# EAGLE design Socket (EAGLE 6.4)
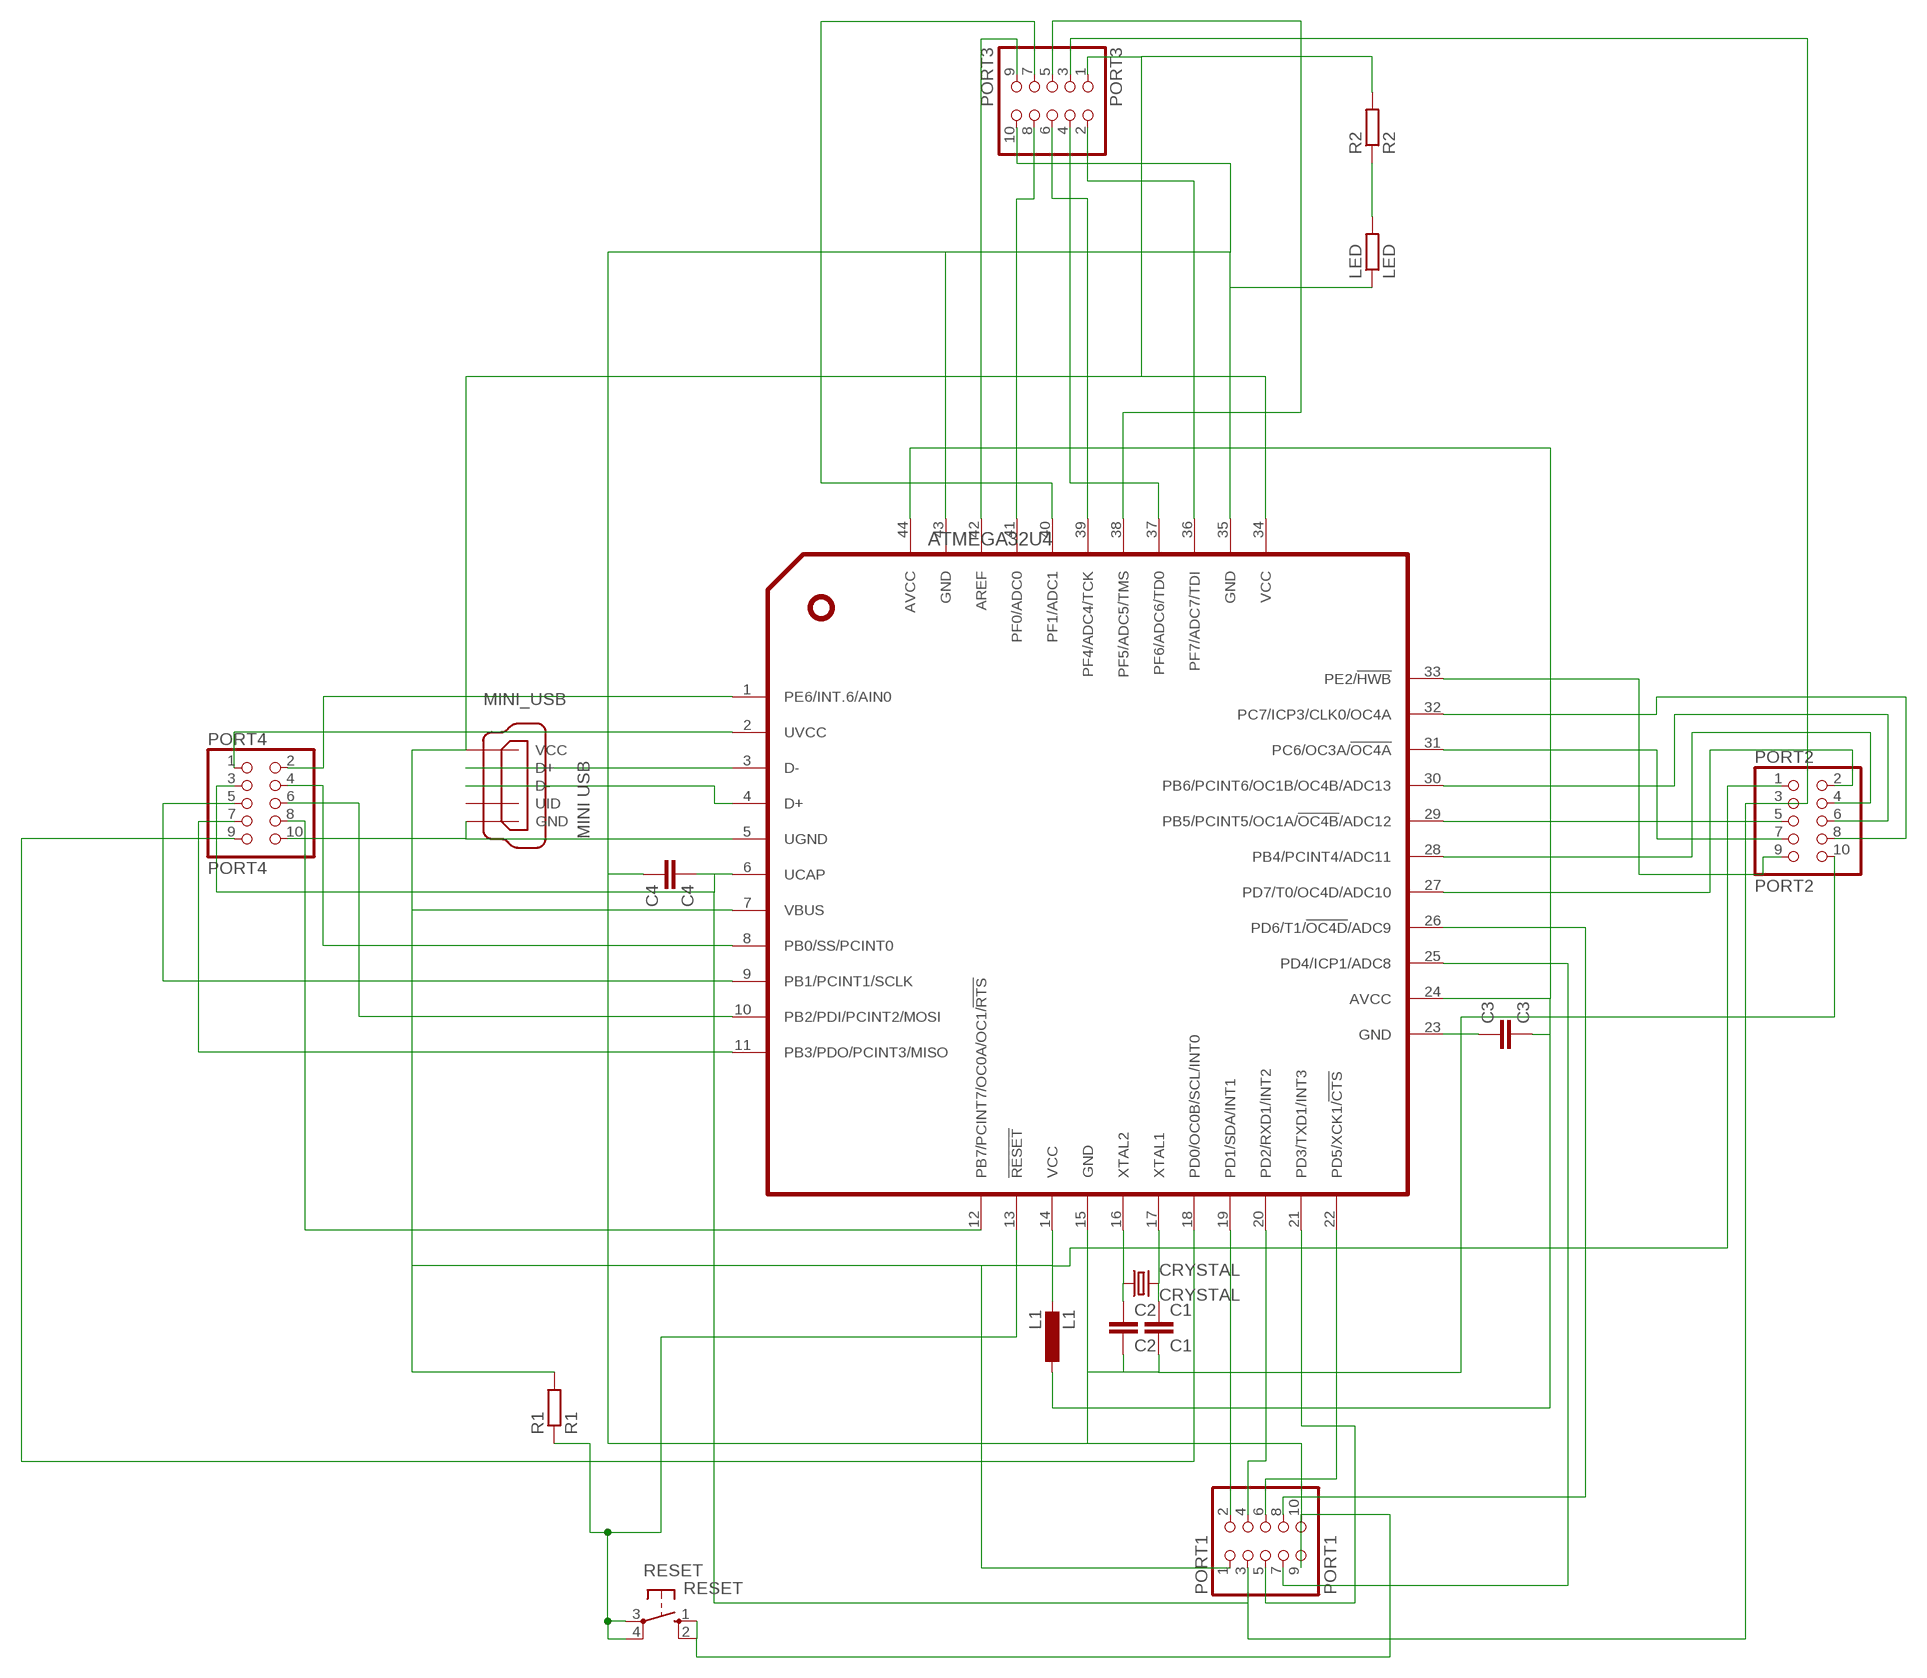
[diagram p0: schematic, sheet 1]

## Parts
ATMEGA32U4  ATMEGA32U4  AT-MEGA16/32-U4  [TQFP44]
C1  C1  C-EUC0603  [C0603]
C2  C2  C-EUC0603  [C0603]
C3  C3  C-EUC0603  [C0603]
C4  C4  C-EUC0603  [C0603]
CRYSTAL  CRYSTAL  CRYSTALHC49UP  [HC49UP]
L1  L1  L-EUL2012C  [L2012C]
LED  LED  R-EU_R0603  [R0603]
MINI_USB  MINI USB  MINI-USB-UX60-MB-5S8  [UX60-MB-5S8]
PORT1  PORT1  PINHD-2X5  [2X05]
PORT2  PORT2  PINHD-2X5  [2X05]
PORT3  PORT3  PINHD-2X5  [2X05]
PORT4  PORT4  PINHD-2X5  [2X05]
R1  R1  R-EU_R0603  [R0603]
R2  R2  R-EU_R0603  [R0603]
RESET  RESET  10-XX  [B3F-10XX]

## Nets
3.3VCC: ATMEGA32U4.6(UCAP) C4.1 PORT1.3 PORT2.3 PORT3.3 PORT4.3
5VCC: ATMEGA32U4.2(UVCC) ATMEGA32U4.7(VBUS) ATMEGA32U4.14(VCC) ATMEGA32U4.34(VCC) L1.2 MINI_USB.VCC PORT1.1 PORT2.1 PORT3.1 PORT4.1 R1.2 R2.2
D+: ATMEGA32U4.4(D+) MINI_USB.D-
GND: ATMEGA32U4.5(UGND) ATMEGA32U4.15(GND) ATMEGA32U4.23(GND) ATMEGA32U4.35(GND) ATMEGA32U4.43(GND) C1.2 C2.2 C3.1 C4.2 LED.1 MINI_USB.GND MINI_USB.GND1(GND) MINI_USB.GND2(GND) MINI_USB.GND3(GND) MINI_USB.GND4(GND) PORT1.9 PORT1.10 PORT2.10 PORT3.10 PORT4.10 RESET.1(S) RESET.2(S1)
N$1: ATMEGA32U4.16(XTAL2) C2.1 CRYSTAL.1
N$2: ATMEGA32U4.17(XTAL1) C1.1 CRYSTAL.2
N$3: ATMEGA32U4.1(PE6/INT.6/AIN0) PORT4.2
N$4: LED.2 R2.1
N$5: ATMEGA32U4.24(AVCC) ATMEGA32U4.44(AVCC) C3.2 L1.1
N$6: ATMEGA32U4.8(PB0/SS/PCINT0) PORT4.4
N$7: ATMEGA32U4.9(PB1/PCINT1/SCLK) PORT4.5
N$8: ATMEGA32U4.3(D-) MINI_USB.D+
N$10: ATMEGA32U4.13(!RESET) R1.1 RESET.3(P) RESET.4(P1)
N$12: ATMEGA32U4.10(PB2/PDI/PCINT2/MOSI) PORT4.6
N$13: ATMEGA32U4.11(PB3/PDO/PCINT3/MISO) PORT4.7
N$14: ATMEGA32U4.12(PB7/PCINT7/OC0A/OC1/!RTS) PORT4.8
N$15: ATMEGA32U4.18(PD0/OC0B/SCL/INT0) PORT4.9
N$16: ATMEGA32U4.19(PD1/SDA/INT1) PORT1.2
N$17: ATMEGA32U4.20(PD2/RXD1/INT2) PORT1.4
N$18: ATMEGA32U4.21(PD3/TXD1/INT3) PORT1.5
N$19: ATMEGA32U4.22(PD5/XCK1/!CTS) PORT1.6
N$20: ATMEGA32U4.25(PD4/ICP1/ADC8) PORT1.7
N$21: ATMEGA32U4.26(PD6/T1/!OC4D!/ADC9) PORT1.8
N$22: ATMEGA32U4.36(PF7/ADC7/TDI) PORT3.2
N$23: ATMEGA32U4.27(PD7/T0/OC4D/ADC10) PORT2.2
N$24: ATMEGA32U4.28(PB4/PCINT4/ADC11) PORT2.4
N$25: ATMEGA32U4.29(PB5/PCINT5/OC1A/!OC4B!/ADC12) PORT2.5
N$26: ATMEGA32U4.30(PB6/PCINT6/OC1B/OC4B/ADC13) PORT2.6
N$27: ATMEGA32U4.31(PC6/OC3A/!OC4A) PORT2.7
N$28: ATMEGA32U4.32(PC7/ICP3/CLK0/OC4A) PORT2.8
N$29: ATMEGA32U4.33(PE2/!HWB) PORT2.9
N$30: ATMEGA32U4.37(PF6/ADC6/TD0) PORT3.4
N$31: ATMEGA32U4.38(PF5/ADC5/TMS) PORT3.5
N$33: ATMEGA32U4.40(PF1/ADC1) PORT3.7
N$34: ATMEGA32U4.41(PF0/ADC0) PORT3.8
N$35: ATMEGA32U4.42(AREF) PORT3.9
PORT3: ATMEGA32U4.39(PF4/ADC4/TCK) PORT3.6
Unconnected: MINI_USB.UID

## Library data of the parts
ATMEGA32U4 = atmel2:AT-MEGA16/32-U4
C1-C4 = rcl:C-EU: CAPACITOR, European symbol
CRYSTAL = crystal:CRYSTAL: CRYSTAL; OC_FARNELL: unknown; OC_NEWARK: unknown
L1 = rcl:L-EU: INDUCTOR, European symbol
LED R1 R2 = rcl:R-EU_: RESISTOR, European symbol
MINI_USB = con-hirose:MINI-USB-: MINI USB Connector Source: http://www.hirose.co.jp/cataloge_hp/e24000019.pdf; OC_FARNELL: unknown; OC_NEWARK: unknown
PORT1-PORT4 = pinhead:PINHD-2X5: PIN HEADER
RESET = switch-omron:10-XX: OMRON SWITCH; MPN: B3F-1000; OC_FARNELL: 176432; OC_NEWARK: 36M3542

## Board
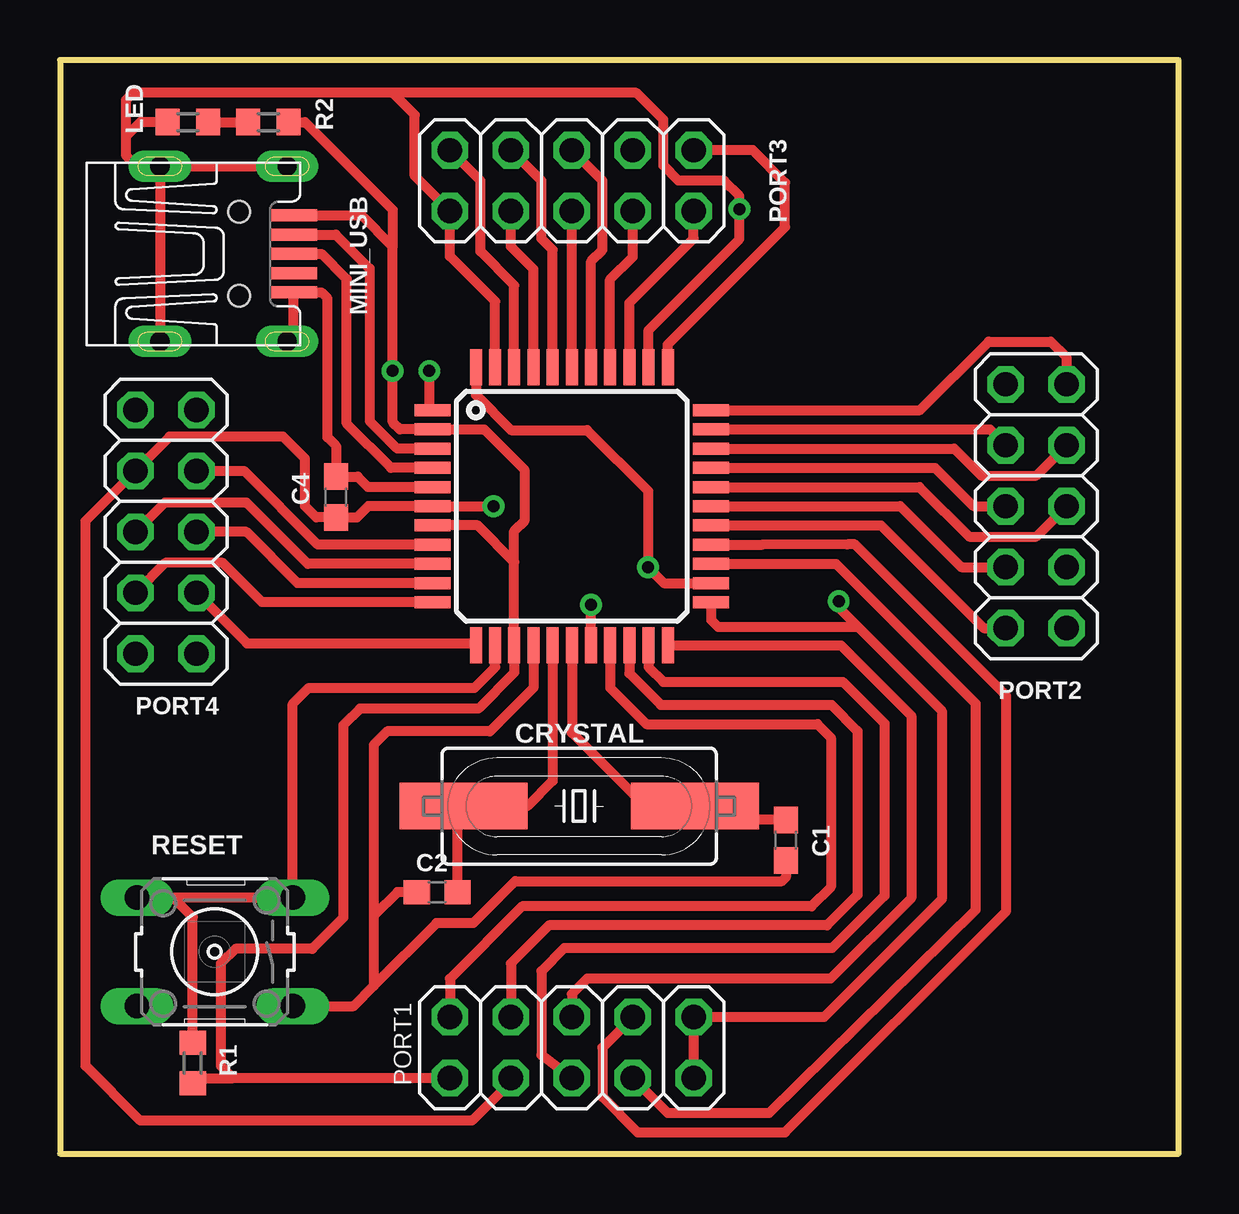
[diagram p1: board, top side]
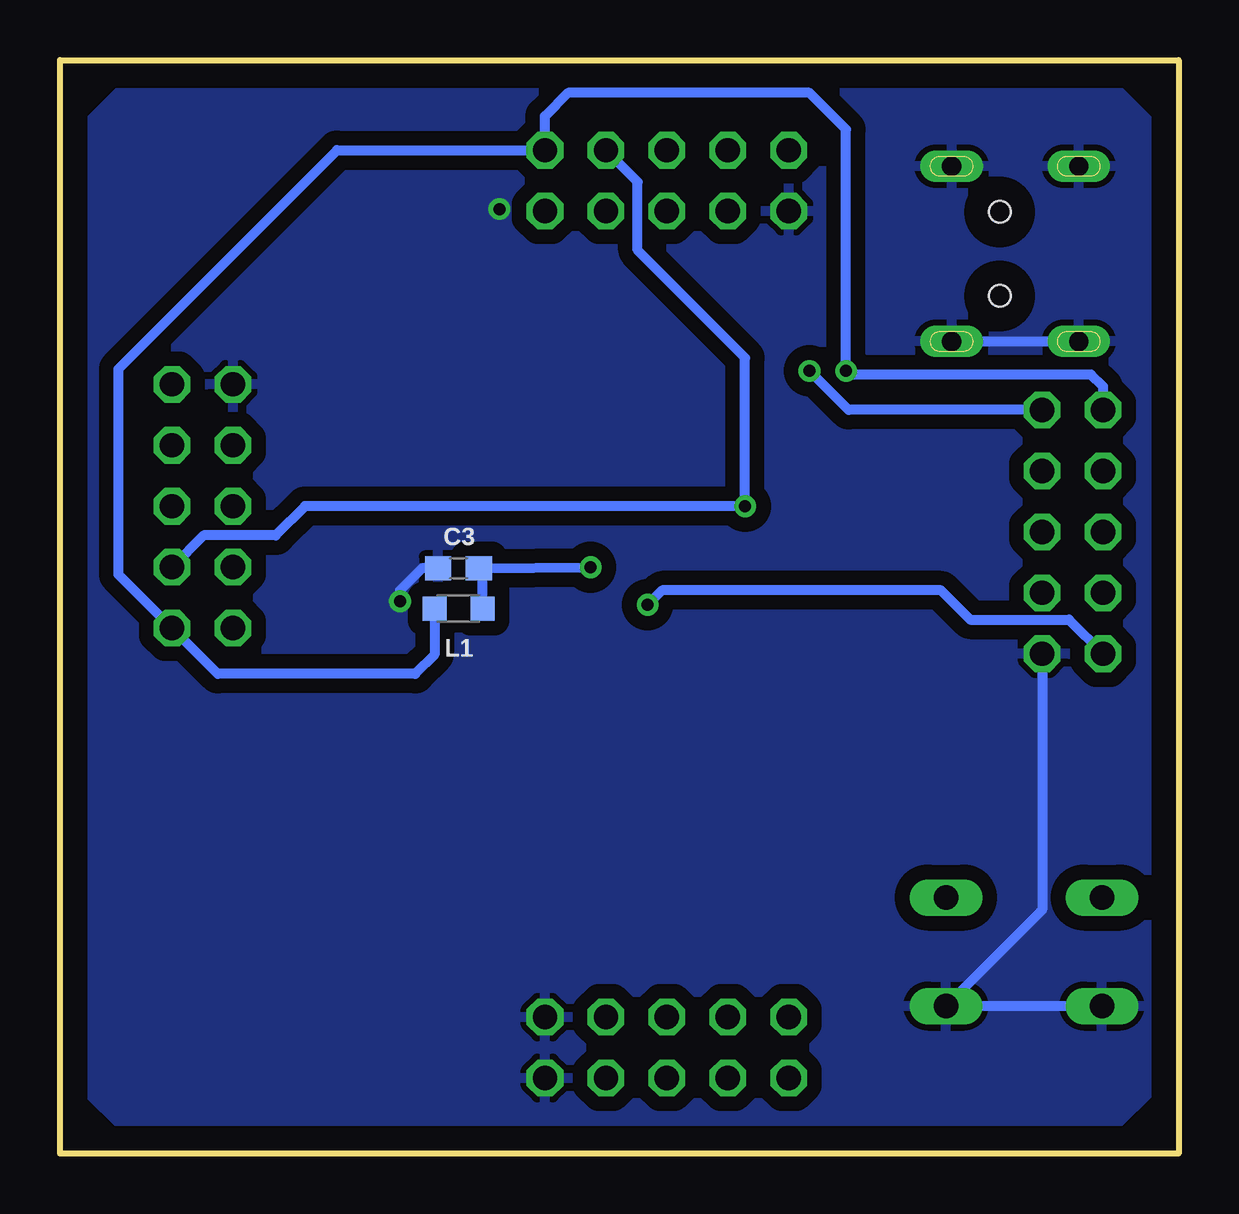
[diagram p2: board, bottom side, seen from below]

Size 46.63 x 45.57 mm. Coordinates in mm from the lower left corner, seen from the top.
Outline: 0,0 46.63,0 46.63,45.57 0,45.57 0,0
Copper layers (1*16): Top 0.035mm / dielectric 1.5mm / Bottom 0.035mm
Design rules: minimum track width 10mil, minimum drill 24mil, track to track 8mil, track to pad 8mil, pad to pad 8mil, via to via 8mil, smd to smd 8mil, copper to edge 40mil, drill to drill 8mil, minimum pad ring 10mil, minimum via ring 8mil, stop-mask expansion 4mil, vias tented up to drill 0mil, thermal gap 10mil

### Footprints (pad centres in the part's own frame; a part is rotated, then mirrored left to right if it is on the bottom)
TQFP44 = smd 1.5 x 0.5: 1 -5.8,4; 2 -5.8,3.2; 3 -5.8,2.4; 4 -5.8,1.6; 5 -5.8,0.8; 6 -5.8,0; 7 -5.8,-0.8; 8 -5.8,-1.6; 9 -5.8,-2.4; 10 -5.8,-3.2; 11 -5.8,-4; 23 5.8,-4; 24 5.8,-3.2; 25 5.8,-2.4; 26 5.8,-1.6; 27 5.8,-0.8; 28 5.8,0; 29 5.8,0.8; 30 5.8,1.6; 31 5.8,2.4; 32 5.8,3.2; 33 5.8,4 | smd 0.5 x 1.5: 12 -4,-5.8; 13 -3.2,-5.8; 14 -2.4,-5.8; 15 -1.6,-5.8; 16 -0.8,-5.8; 17 0,-5.8; 18 0.8,-5.8; 19 1.6,-5.8; 20 2.4,-5.8; 21 3.2,-5.8; 22 4,-5.8; 34 4,5.8; 35 3.2,5.8; 36 2.4,5.8; 37 1.6,5.8; 38 0.8,5.8; 39 0,5.8; 40 -0.8,5.8; 41 -1.6,5.8; 42 -2.4,5.8; 43 -3.2,5.8; 44 -4,5.8
C0603 = smd 1.1 x 1: 1 -0.85,0; 2 0.85,0
HC49UP = smd 5.334 x 1.93: 1 -4.826,0; 2 4.826,0
L2012C = smd 1 x 1: 1 -1,0; 2 1,0
R0603 = smd 1 x 1.1: 1 -0.85,0; 2 0.85,0
UX60-MB-5S8 = smd 2 x 0.5: D+ 8.65,0.8; D- 8.65,0; GND 8.65,-1.6; UID 8.65,-0.8; VCC 8.65,1.6 | drill 0.8 long: GND1 8.4,-3.65; GND2 3.1,-3.65; GND3 3.1,3.65; GND4 8.4,3.65 | hole 0.9: 6.4,-1.75; 6.4,1.75
2X05 = drill 1.016 octagon: 1 -5.08,-1.27; 2 -5.08,1.27; 3 -2.54,-1.27; 4 -2.54,1.27; 5 0,-1.27; 6 0,1.27; 7 2.54,-1.27; 8 2.54,1.27; 9 5.08,-1.27; 10 5.08,1.27
B3F-10XX = drill 1.016 long: 1 -3.251,2.261; 2 3.251,2.261; 3 -3.251,-2.261; 4 3.251,-2.261

### Placement (x,y rotation side)
ATMEGA32U4  21.34,26.97 0 top
C1  30.25,13.06 270 top
C2  15.72,10.9 180 top
C3  30.02,24.38 0 bottom
C4  11.51,27.36 90 top
CRYSTAL  21.64,14.48 0 top
L1  30.02,22.71 180 bottom
LED  5.33,42.98 0 top
MINI_USB  1.07,37.49 0 top
PORT1  21.34,4.42 0 top
PORT2  40.69,26.97 90 top
PORT3  21.34,40.54 180 top
PORT4  4.42,25.91 270 top
R1  5.54,3.77 270 top
R2  8.69,42.98 0 top
RESET  6.45,8.41 180 top

### Tracks (layer width: path | path; a pad name or v marks a point on that pad's centre or on a via)
3.3VCC  (via drill 0.5 pad 0.81)
  Top 0.406: v18.07,26.98 ATMEGA32U4.6 12.85,26.98 12.38,26.51 C4.1 10.68,26.51 10.21,26.98 10.21,28.96 9.3,29.87 4.57,29.87 PORT4.3 1.07,26.36 1.07,3.66 3.35,1.37 17.17,1.37 18.8,3 PORT1.3
  Bottom 0.406: PORT2.3 40.64,25.76 37.64,25.76 36.42,26.98 v18.07,26.98 18.07,33.16 22.55,37.64 22.55,40.49 PORT3.3
5VCC  (via drill 0.5)
  Top 0.406: PORT3.1 28.88,41.81 30.23,40.46 30.23,38.61 25.34,33.72 ATMEGA32U4.34 | ATMEGA32U4.7 17.41,26.18 18.94,24.65 | 13.87,37.8 v13.87,32.61 13.87,30.48 14.17,30.18 ATMEGA32U4.2 17.68,30.18 19.36,28.5 19.36,26.36 18.94,25.95 18.94,24.65 | 13.87,37.8 12.57,39.09 MINI_USB.VCC | 13.87,37.8 13.87,39.32 10.21,42.98 R2.2 | 7.21,3.15 6.71,3.66 6.71,7.92 7.32,8.53 10.52,8.53 11.81,9.83 11.81,17.85 12.5,18.54 17.44,18.54 18.94,20.04 ATMEGA32U4.14 18.94,24.65 | PORT1.1 7.21,3.15 | R1.2 5.76,3.15 7.21,3.15
  Bottom 0.406: PORT4.1 3.15,31.95 3.66,32.46 13.72,32.46 v13.87,32.61 13.87,42.67 15.39,44.2 25.45,44.2 26.42,43.23 PORT3.1 35.09,41.81 44.2,32.7 44.2,24.13 PORT2.1 40.06,19.99 31.83,19.99 31.02,20.79 L1.2
D+
  Top 0.406: MINI_USB.D- 10.9,37.49 11.95,36.44 11.95,30.42 13.79,28.57 ATMEGA32U4.4
GND  (via drill 0.5)
  Top 0.406: ATMEGA32U4.5 12.84,27.77 12.41,28.21 C4.2 11.51,29.49 11.15,29.84 11.15,35.64 10.9,35.89 MINI_USB.GND 9.72,34.09 MINI_USB.GND1 | 33.26,21.95 36.75,18.45 36.75,10.59 31.85,5.69 PORT1.10 PORT1.9 | ATMEGA32U4.35 24.54,34.31 28.32,38.1 v28.32,39.36 28.32,39.9 27.69,40.54 25.78,40.54 25.15,41.17 25.15,43.08 24.03,44.2 13.87,44.2 | ATMEGA32U4.43 18.14,35.51 16.26,37.39 PORT3.10 14.78,40.74 14.78,43.28 13.87,44.2 | 19.75,21.19 ATMEGA32U4.15 19.74,19.4 17.92,17.59 13.64,17.59 13.08,17.03 13.08,9.91 | 13.08,9.91 13.08,6.99 | MINI_USB.GND3 MINI_USB.GND2 | MINI_USB.GND3 MINI_USB.GND4 | MINI_USB.GND3 4.12,41.19 3.16,41.19 2.74,41.6 2.74,42.37 | 13.08,6.99 12.24,6.15 RESET.1 | 2.74,42.37 2.74,43.89 3.05,44.2 13.87,44.2 | C2.2 14.07,10.9 13.08,9.91 | 13.08,6.99 15.7,9.6 17.22,9.6 18.97,11.35 30.1,11.35 30.25,11.51 C1.2 | LED.1 3.35,42.98 2.74,42.37 | ATMEGA32U4.23 27.14,22.24 27.43,21.95 33.26,21.95 | 33.26,21.95 32.46,22.74 v32.46,23.01
  Bottom 0.406: MINI_USB.GND1 5.18,33.84 | 5.18,33.84 MINI_USB.GND2 | RESET.2 RESET.1 5.69,10.16 PORT4.10 | 5.17,33.83 5.18,33.84 | C3.1 31.55,24.38 32.46,23.47 v32.46,23.01
  pour Bottom (isolate 0.61): 3.05,44.82 43.6,44.82 45.89,42.53 45.89,2.96 43.66,0.74 3.04,0.74 0.74,3.04 0.74,42.51
N$1
  Top 0.406: ATMEGA32U4.16 20.54,15.53 19.48,14.48 CRYSTAL.1 16.57,13.93 C2.1
N$2
  Top 0.406: C1.1 26.73,13.91 CRYSTAL.2 24.69,14.17 21.34,17.53 ATMEGA32U4.17
N$3  (via drill 0.5)
  Top 0.406: v15.39,32.61 15.39,31.12 ATMEGA32U4.1
  Bottom 0.406: PORT4.2 13.77,30.99 v15.39,32.61
N$4
  Top 0.406: LED.2 R2.1
N$5  (via drill 0.5)
  Top 0.406: ATMEGA32U4.24 25.17,23.77 v24.51,24.43 24.51,27.61 21.97,30.15 18.8,30.15 17.34,31.61 ATMEGA32U4.44
  Bottom 0.406: v24.51,24.43 C3.2 29.02,24.23 L1.1
N$6
  Top 0.406: ATMEGA32U4.8 10.74,25.38 7.67,28.45 PORT4.4
N$7
  Top 0.406: ATMEGA32U4.9 10.32,24.57 7.77,27.13 4.37,27.13 PORT4.5
N$8
  Top 0.406: MINI_USB.D+ 11.5,38.29 12.92,36.87 12.92,30.52 14.06,29.38 ATMEGA32U4.3
N$10
  Top 0.406: ATMEGA32U4.13 18.14,20.27 17.27,19.41 10.37,19.41 9.7,18.74 RESET.3 4.72,10.67 | 4.72,10.67 RESET.4 | R1.1 5.54,9.86 4.72,10.67
N$12
  Top 0.406: ATMEGA32U4.10 9.91,23.77 7.77,25.91 PORT4.6
N$13
  Top 0.406: ATMEGA32U4.11 8.42,22.98 6.78,24.61 4.39,24.61 PORT4.7
N$14
  Top 0.406: ATMEGA32U4.12 17.25,21.26 7.8,21.26 PORT4.8
N$15  (via drill 0.5)
  Top 0.406: ATMEGA32U4.18 v22.14,22.87
  Bottom 0.406: v22.14,22.87 21.54,23.47 9.91,23.47 8.69,22.25 4.57,22.25 PORT4.9
N$16
  Top 0.406: ATMEGA32U4.19 22.94,19.4 24.45,17.89 31.57,17.89 32.13,17.34 32.13,11.1 31.33,10.3 19.27,10.3 16.26,7.29 PORT1.2
N$17
  Top 0.406: ATMEGA32U4.20 23.74,20.01 25.05,18.69 32.16,18.69 33.25,17.6 33.25,10.78 31.98,9.51 20.38,9.51 18.8,7.92 PORT1.4
N$18
  Top 0.406: PORT1.5 20.07,4.12 20.07,7.61 21.02,8.56 32.18,8.56 34.37,10.74 34.37,17.93 32.63,19.66 25.15,19.66 24.54,20.27 ATMEGA32U4.21
N$19
  Top 0.406: PORT1.6 21.34,6.66 21.97,7.29 32.12,7.29 35.48,10.65 35.48,18.25 32.56,21.18 ATMEGA32U4.22
N$20
  Top 0.406: PORT1.7 25.32,1.7 29.57,1.7 38.18,10.16 38.18,18.75 32.35,24.57 ATMEGA32U4.25
N$21
  Top 0.406: PORT1.8 22.61,4.42 22.61,2.36 24.08,0.89 30.23,0.89 39.45,10.11 39.45,19.07 33.13,25.39 32.82,25.39 29.29,25.38 ATMEGA32U4.26
N$22
  Top 0.406: ATMEGA32U4.36 23.74,35.45 26.42,38.12 PORT3.2
N$23
  Top 0.406: ATMEGA32U4.27 34.23,26.18 38.51,21.89 PORT2.2
N$24
  Top 0.406: ATMEGA32U4.28 35.03,26.98 37.57,24.43 PORT2.4
N$25
  Top 0.406: ATMEGA32U4.29 35.83,27.77 37.9,25.7 40.69,25.7 PORT2.5
N$26
  Top 0.406: ATMEGA32U4.30 36.48,28.57 38.08,26.98 PORT2.6
N$27
  Top 0.406: ATMEGA32U4.31 37.27,29.38 38.41,28.25 40.69,28.25 PORT2.7
N$28
  Top 0.406: ATMEGA32U4.32 38.76,30.18 PORT2.8
N$29
  Top 0.406: ATMEGA32U4.33 35.85,30.98 38.71,33.83 41.3,33.83 41.96,33.17 PORT2.9
N$30
  Top 0.406: ATMEGA32U4.37 22.94,36.42 23.88,37.36 PORT3.4
N$31
  Top 0.406: ATMEGA32U4.38 22.14,37.17 22.61,37.64 22.61,40.54 PORT3.5
N$33
  Top 0.406: ATMEGA32U4.40 20.54,37.66 20.07,38.12 20.07,40.54 PORT3.7
N$34
  Top 0.406: ATMEGA32U4.41 19.74,36.85 18.8,37.8 PORT3.8
N$35
  Top 0.406: ATMEGA32U4.42 18.94,36.18 17.53,37.59 17.53,40.54 PORT3.9
PORT3
  Top 0.406: ATMEGA32U4.39 PORT3.6

### Text on the board
tValues: AREF | PF.1 | PF.5 | 3.3V | 5V | Controller / Socket | GND | PF.0 | PF.4 | PF.6 | PF.7 | 5V | GND | PE.2 | PE.6 | PC.7 | PC.6 | 3.3V | PB.0 | PB.6 | PB.5 | PB.2 | PB.1 | PB.4 | 3.3V | PB.7 | PB.3 | 5V | PD.7 | GND | PD.0 | PD.1 | PD.2 | PD.5 | PD.6 | GND | 5V | 3.3V | PD.3 | PD.4